# EAGLE design doorjamb_rev_a (EAGLE 7.6.0)
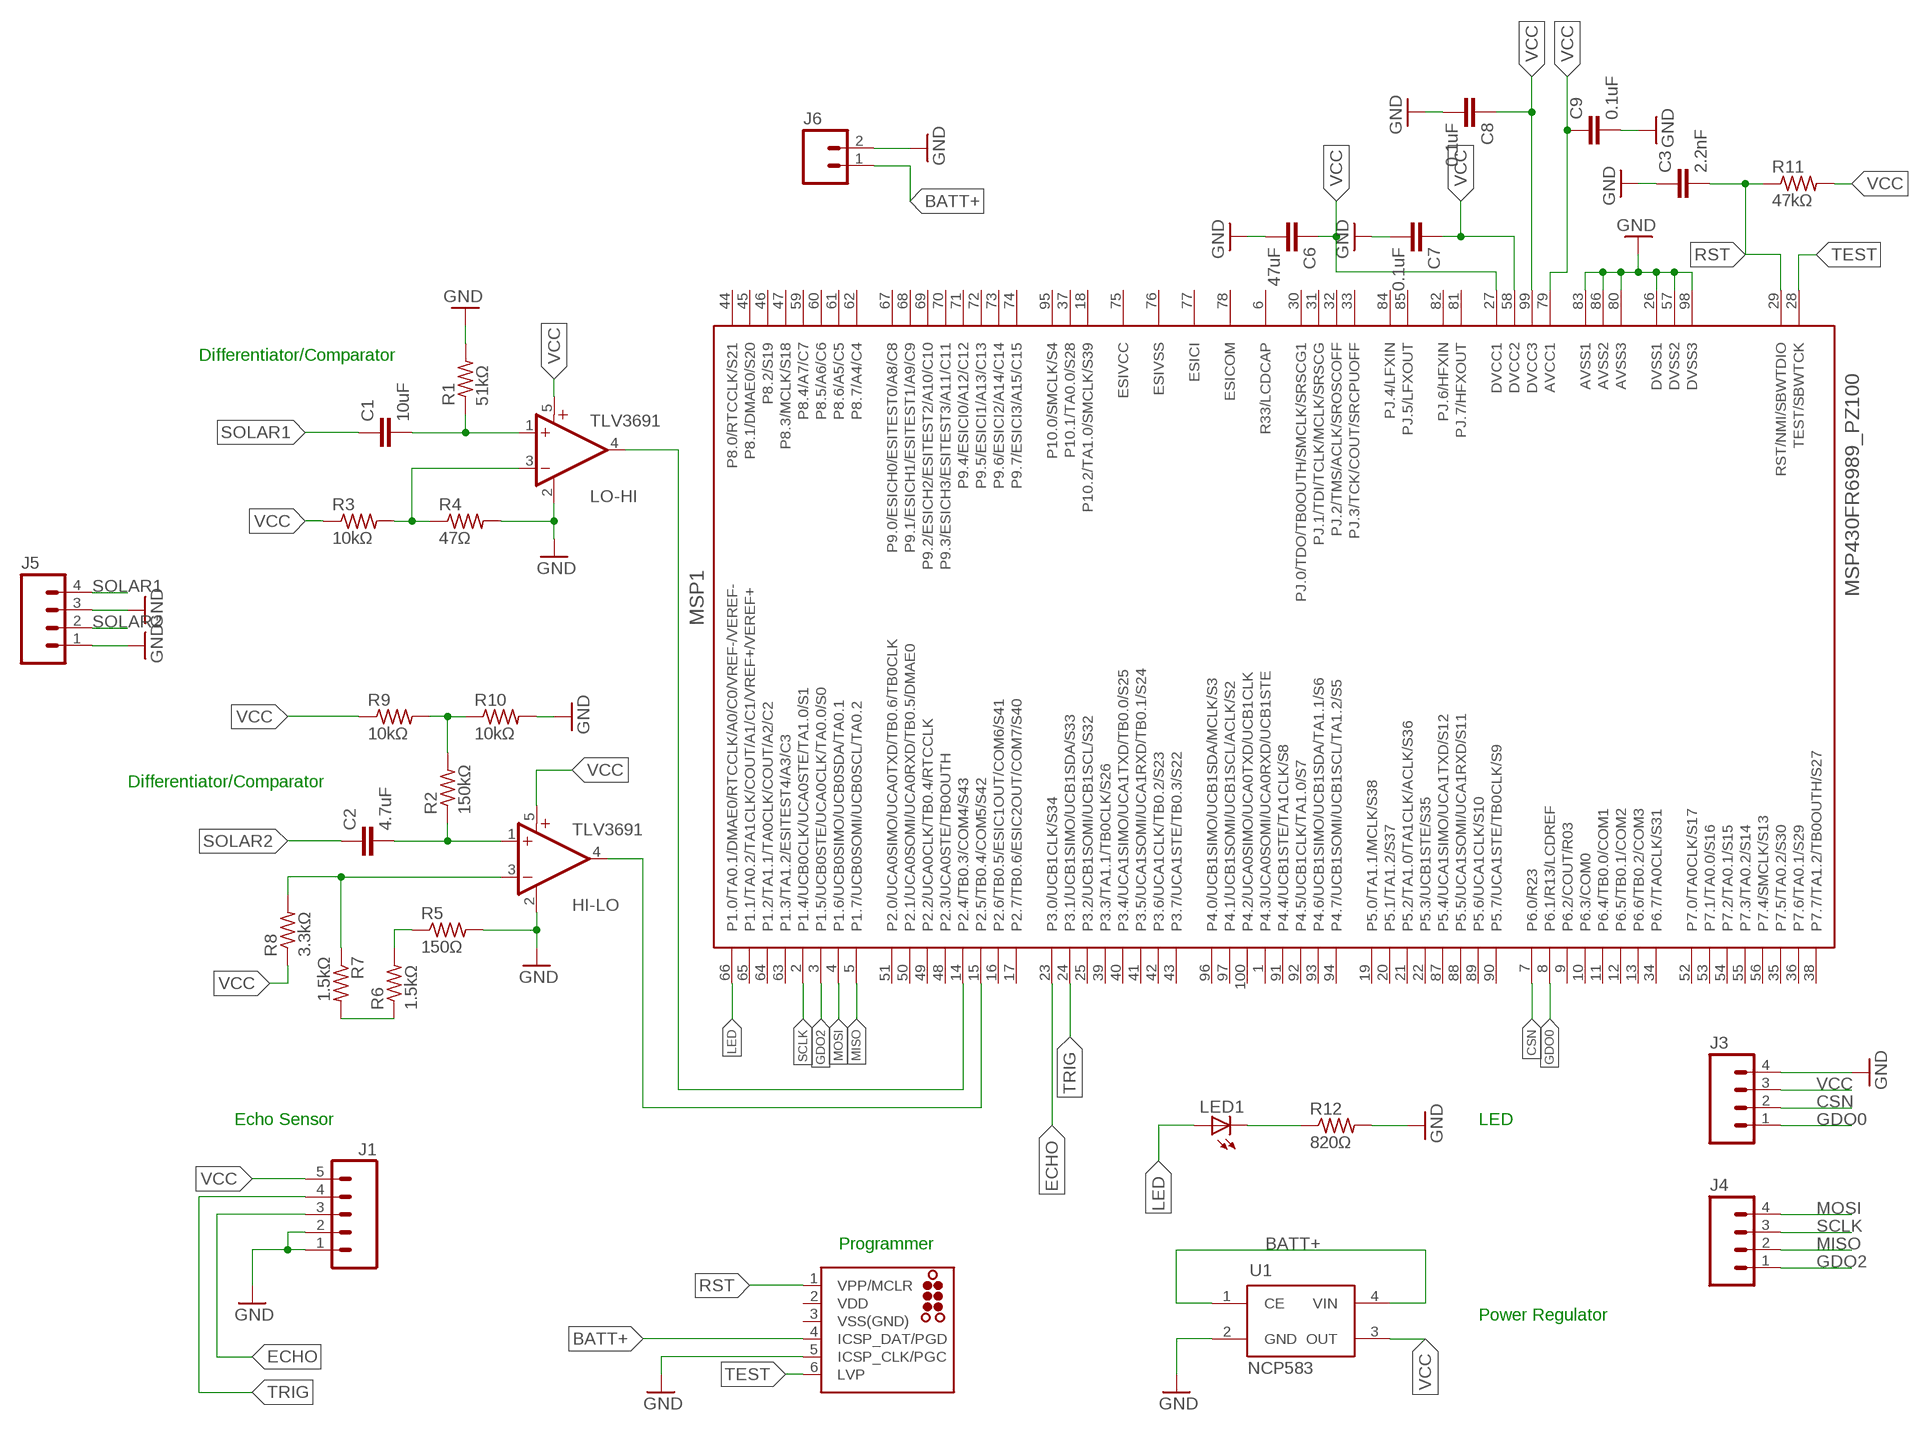
[diagram p0: schematic, sheet 1]

## Parts
C1  10uF  CAP0805  [0805]
C2  4.7uF  CAP0805  [0805]
C3  2.2nF  CAP0805  [0805]
C6  47uF  CAP0805  [0805]
C7  0.1uF  CAP0805  [0805]
C8  0.1uF  CAP0805  [0805]
C9  0.1uF  CAP0805  [0805]
HI-LO  TLV3691  [SC70-5]
J1  M05PTH  [1X05]
J2  TC2030-MCP-NL  [TC2030-MCP-NL]
J3  M04PTH  [1X04]
J4  M04PTH  [1X04]
J5  M04PTH  [1X04]
J6  M02PTH  [1X02]
LED1  LEDCHIP-LED0805  [CHIP-LED0805]
LO-HI  TLV3691  [SC70-5]
MSP1  MSP430FR6989_PZ100  [PZ100]
R1  51kΩ  R-US_M0805  [M0805]
R2  150kΩ  R-US_M0805  [M0805]
R3  10kΩ  R-US_M0805  [M0805]
R4  47Ω  R-US_M0805  [M0805]
R5  150Ω  R-US_M0805  [M0805]
R6  1.5kΩ  R-US_M0805  [M0805]
R7  1.5kΩ  R-US_M0805  [M0805]
R8  3.3kΩ  R-US_M0805  [M0805]
R9  10kΩ  R-US_M0805  [M0805]
R10  10kΩ  R-US_M0805  [M0805]
R11  47kΩ  R-US_M0805  [M0805]
R12  820Ω  R-US_M0805  [M0805]
U1  NCP583  [SC82-AB_1PRIMARY]

## Nets
BATT+: J2.4(ICSP_DAT/PGD) J6.1 U1.1(CE) U1.4(VIN)
CSN: J3.2 MSP1.7(P6.0/R23)
ECHO: J1.3 MSP1.23(P3.0/UCB1CLK/S34)
GDO0: J3.1 MSP1.8(P6.1/R13/LCDREF)
GDO2: J4.1 MSP1.3(P1.5/UCB0STE/UCA0CLK/TA0.0/S0)
GND: C3.1 C6.2 C7.2 C8.2 C9.2 HI-LO.2(GND) J1.1 J1.2 J2.5(ICSP_CLK/PGC) J3.4 J5.1 J5.3 J6.2 LO-HI.2(GND) MSP1.26(DVSS1) MSP1.57(DVSS2) MSP1.80(AVSS3) MSP1.83(AVSS1) MSP1.86(AVSS2) MSP1.98(DVSS3) R1.2 R4.2 R5.2 R10.2 R12.2 U1.2(GND)
LED: LED1.A MSP1.66(P1.0/TA0.1/DMAE0/RTCCLK/A0/C0/VREF-/VEREF-)
MISO: J4.2 MSP1.5(P1.7/UCB0SOMI/UCB0SCL/TA0.2)
MOSI: J4.4 MSP1.4(P1.6/UCB0SIMO/UCB0SDA/TA0.1)
N$1: C1.2 LO-HI.1(+IN) R1.1
N$2: C2.2 HI-LO.1(+IN) R2.1
N$3: LO-HI.3(-IN) R3.2 R4.1
N$4: R5.1 R6.2
N$5: R6.1 R7.2
N$6: HI-LO.3(-IN) R7.1 R8.2
N$7: LED1.C R12.1
N$8: R2.2 R9.2 R10.1
N$9: LO-HI.4(OUT) MSP1.14(P2.4/TB0.3/COM4/S43)
N$10: HI-LO.4(OUT) MSP1.15(P2.5/TB0.4/COM5/S42)
RST: C3.2 J2.1(VPP/MCLR) MSP1.29(RST/NMI/SBWTDIO) R11.1
SCLK: J4.3 MSP1.2(P1.4/UCB0CLK/UCA0STE/TA1.0/S1)
SOLAR1: C1.1 J5.4
SOLAR2: C2.1 J5.2
TEST: J2.6(LVP) MSP1.28(TEST/SBWTCK)
TRIG: J1.4 MSP1.24(P3.1/UCB1SIMO/UCB1SDA/S33)
VCC: C6.1 C7.1 C8.1 C9.1 HI-LO.5(V+) J1.5 J3.3 LO-HI.5(V+) MSP1.27(DVCC1) MSP1.58(DVCC2) MSP1.79(AVCC1) MSP1.99(DVCC3) R3.1 R8.1 R9.1 R11.2 U1.3(OUT)
Unconnected: MSP1.1(P4.3/UCA0SOMI/UCA0RXD/UCB1STE) MSP1.6(R33/LCDCAP) MSP1.9(P6.2/COUT/R03) MSP1.10(P6.3/COM0) MSP1.11(P6.4/TB0.0/COM1) MSP1.12(P6.5/TB0.1/COM2) MSP1.13(P6.6/TB0.2/COM3) MSP1.16(P2.6/TB0.5/ESIC1OUT/COM6/S41) MSP1.17(P2.7/TB0.6/ESIC2OUT/COM7/S40) MSP1.18(P10.2/TA1.0/SMCLK/S39) MSP1.19(P5.0/TA1.1/MCLK/S38) MSP1.20(P5.1/TA1.2/S37) MSP1.21(P5.2/TA1.0/TA1CLK/ACLK/S36) MSP1.22(P5.3/UCB1STE/S35) MSP1.25(P3.2/UCB1SOMI/UCB1SCL/S32) MSP1.30(PJ.0/TDO/TB0OUTH/SMCLK/SRSCG1) MSP1.31(PJ.1/TDI/TCLK/MCLK/SRSCG) MSP1.32(PJ.2/TMS/ACLK/SROSCOFF) MSP1.33(PJ.3/TCK/COUT/SRCPUOFF) MSP1.34(P6.7/TA0CLK/S31) MSP1.35(P7.5/TA0.2/S30) MSP1.36(P7.6/TA0.1/S29) MSP1.37(P10.1/TA0.0/S28) MSP1.38(P7.7/TA1.2/TB0OUTH/S27) MSP1.39(P3.3/TA1.1/TB0CLK/S26) MSP1.40(P3.4/UCA1SIMO/UCA1TXD/TB0.0/S25) MSP1.41(P3.5/UCA1SOMI/UCA1RXD/TB0.1/S24) MSP1.42(P3.6/UCA1CLK/TB0.2/S23) MSP1.43(P3.7/UCA1STE/TB0.3/S22) MSP1.44(P8.0/RTCCLK/S21) MSP1.45(P8.1/DMAE0/S20) MSP1.46(P8.2/S19) MSP1.47(P8.3/MCLK/S18) MSP1.48(P2.3/UCA0STE/TB0OUTH) MSP1.49(P2.2/UCA0CLK/TB0.4/RTCCLK) MSP1.50(P2.1/UCA0SOMI/UCA0RXD/TB0.5/DMAE0) MSP1.51(P2.0/UCA0SIMO/UCA0TXD/TB0.6/TB0CLK) MSP1.52(P7.0/TA0CLK/S17) MSP1.53(P7.1/TA0.0/S16) MSP1.54(P7.2/TA0.1/S15) MSP1.55(P7.3/TA0.2/S14) MSP1.56(P7.4/SMCLK/S13) MSP1.59(P8.4/A7/C7) MSP1.60(P8.5/A6/C6) MSP1.61(P8.6/A5/C5) MSP1.62(P8.7/A4/C4) MSP1.63(P1.3/TA1.2/ESITEST4/A3/C3) MSP1.64(P1.2/TA1.1/TA0CLK/COUT/A2/C2) MSP1.65(P1.1/TA0.2/TA1CLK/COUT/A1/C1/VREF+/VEREF+) MSP1.67(P9.0/ESICH0/ESITEST0/A8/C8) MSP1.68(P9.1/ESICH1/ESITEST1/A9/C9) MSP1.69(P9.2/ESICH2/ESITEST2/A10/C10) MSP1.70(P9.3/ESICH3/ESITEST3/A11/C11) MSP1.71(P9.4/ESICI0/A12/C12) MSP1.72(P9.5/ESICI1/A13/C13) MSP1.73(P9.6/ESICI2/A14/C14) MSP1.74(P9.7/ESICI3/A15/C15) MSP1.75(ESIVCC) MSP1.76(ESIVSS) MSP1.77(ESICI) MSP1.78(ESICOM) MSP1.81(PJ.7/HFXOUT) MSP1.82(PJ.6/HFXIN) MSP1.84(PJ.4/LFXIN) MSP1.85(PJ.5/LFXOUT) MSP1.87(P5.4/UCA1SIMO/UCA1TXD/S12) MSP1.88(P5.5/UCA1SOMI/UCA1RXD/S11) MSP1.89(P5.6/UCA1CLK/S10) MSP1.90(P5.7/UCA1STE/TB0CLK/S9) MSP1.91(P4.4/UCB1STE/TA1CLK/S8) MSP1.92(P4.5/UCB1CLK/TA1.0/S7) MSP1.93(P4.6/UCB1SIMO/UCB1SDA/TA1.1/S6) MSP1.94(P4.7/UCB1SOMI/UCB1SCL/TA1.2/S5) MSP1.95(P10.0/SMCLK/S4) MSP1.96(P4.0/UCB1SIMO/UCB1SDA/MCLK/S3) MSP1.97(P4.1/UCB1SOMI/UCB1SCL/ACLK/S2) MSP1.100(P4.2/UCA0SIMO/UCA0TXD/UCB1CLK)

## Notes on the sheet
- Differentiator/Comparator
- Differentiator/Comparator
- Echo Sensor | LED
- Programmer
- Power Regulator

## Power pins joined to a net without a drawn wire
VDD: J2.2(VDD)
VSS(GND): J2.3(VSS(GND))

## Library data of the parts
C1-C3 C6-C9 = SparkFun-Capacitors:CAP: Capacitor Standard 0603 ceramic capacitor, and 0.1" leaded capacitor.
HI-LO LO-HI = fedpower:TLV3691: 0.9-V to 6.5-V, Nanopower Comparator Datasheets Analog Signal Chain Guide <http://www.ti.com/lit/pdf/slyb174> TLV3691 <http://www.ti.com/lit/ds/symlink/tlv3691.pdf> Manufacturer Product Page TLV3691IDPFR Specifications <http://www.ti.com/general/docs/suppproductinfo.tsp?distId=10&orderablePartNumber=TLV3691IDPFR> Standard Package <javascript:dlgHelp('Standard%20Packaging%20Help');> 1 Category Integrated Circuits (ICs) </product-search/en/integrated-circuits-ics> Family Linear - Comparators </product-search/en/integrated-circuits-ics/linear-comparators/2556221> Series - Packaging <javascript:dlgHelp('Standard%20Packaging%20Help');> Cut Tape (CT) <javascript:dlgHelp('Cut%20Tape%20Help');> Type General Purpose Number of Elements 1 Output Type Push-Pull Voltage - Supply, Single/Dual (±) 0.9 V ~ 6.5 V, ±0.45 V ~ 3.25 V Voltage - Input Offset (Max) 3mV Current - Input Bias (Max) 100pA Current - Output (Typ) 42mA Current - Quiescent (Max) 150nA CMRR, PSRR (Typ) - Propagation Delay (Max) 35µs Hysteresis - Operating Temperature -40°C ~ 125°C Package / Case 6-XFDFN Mounting Type Surface Mount Supplier Device Package 6-X2SON (1x1) Online Catalog Comparators - 1 element </catalog/en/partgroup/comparators-1-element/3112?mpart=TLV3691IDPFR&vendor=296&WT.z_ref_page_type=PS&WT.z_ref_page_sub_type=PD&WT.z_ref_page_id=PD&WT.z_ref_page_event=DC_Link_Table> Other Names 296-37242-1
J1 = SparkFun-Connectors:M05: Header 5 Standard 5-pin 0.1" header. Use with straight break away headers (SKU : PRT-00116), right angle break away headers (PRT-00553), swiss pins (PRT-00743), machine pins (PRT-00117), and female headers (PRT-00115). Molex polarized connector foot print use with SKU : PRT-08230 with associated crimp pins and housings.
J2 = tag-connect_msp430:TC2030: TAG-CONNECT ICSP Connector Manufacturer: Tag-Connect <http://www.tag-connect.com> Cable for easy In-Circuit Serial Programming. Designed for Microchip ICD2, suitable for many others. Two variants - one "with legs" (for hands-free fit on PCB) and another "without legs" for quick programming. PAD Description 1 MCLR/Vpp 2 Vdd 3 GND 4 PGD (ISPDAT) 5 PGC (ISPCLK) 6 nc (used for LVP) ©2009 ROFA.cz - modified and updated by Robert Darlington ‹rdarlington@gmail.com›
J3-J5 = SparkFun-Connectors:M04: Header 4 Standard 4-pin 0.1" header. Use with straight break away headers (SKU : PRT-00116), right angle break away headers (PRT-00553), swiss pins (PRT-00743), machine pins (PRT-00117), and female headers (PRT-00115). Molex polarized connector foot print use with SKU : PRT-08231 with associated crimp pins and housings. 1MM SMD Version SKU: PRT-10208; PROD_ID: CONN-09696
J6 = SparkFun-Connectors:M02: Standard 2-pin 0.1" header. Use with - straight break away headers ( PRT-00116) - right angle break away headers (PRT-00553) - swiss pins (PRT-00743) - machine pins (PRT-00117) - female headers (PRT-00115) Molex polarized connector foot print use with: PRT-08233 with associated crimp pins and housings. 2.54_SCREWTERM for use with PRT-10571. 3.5mm Screw Terminal footprints for PRT-08084 5mm Screw Terminal footprints for use with PRT-08432
LED1 = led:LED: LED OSRAM: - CHIPLED LG R971, LG N971, LY N971, LG Q971, LY Q971, LO R971, LY R971 LH N974, LH R974 LS Q976, LO Q976, LY Q976 LO Q996 - Hyper CHIPLED LW Q18S LB Q993, LB Q99A, LB R99A - SideLED LS A670, LO A670, LY A670, LG A670, LP A670 LB A673, LV A673, LT A673, LW A673 LH A674 LY A675 LS A676, LA A676, LO A676, LY A676, LW A676 LS A679, LY A679, LG A679 - Hyper Micro SIDELED® LS Y876, LA Y876, LO Y876, LY Y876 LT Y87S - SmartLED LW L88C, LW L88S LB L89C, LB L89S, LG L890 LS L89K, LO L89K, LY L89K LS L896, LA L896, LO L896, LY L896 - TOPLED LS T670, LO T670, LY T670, LG T670, LP T670 LSG T670, LSP T670, LSY T670, LOP T670, LYG T670 LG T671, LOG T671, LSG T671 LB T673, LV T673, LT T673, LW T673 LH T674 LS T676, LA T676, LO T676, LY T676, LB T676, LH T676, LSB T676, LW T676 LB T67C, LV T67C, LT T67C, LS T67K, LO T67K, LY T67K, LW E67C LS E67B, LA E67B, LO E67B, LY E67B, LB E67C, LV E67C, LT E67C LW T67C LS T679, LY T679, LG T679 LS T770, LO T770, LY T770, LG T770, LP T770 LB T773, LV T773, LT T773, LW T773 LH T774 LS E675, LA E675, LY E675, LS T675 LS T776, LA T776, LO T776, LY T776, LB T776 LHGB T686 LT T68C, LB T68C - Hyper Mini TOPLED® LB M676 - Mini TOPLED Santana® LG M470 LS M47K, LO M47K, LY M47K Source: http://www.osram.convergy.de LUXEON: - LUMILED® LXK2-PW12-R00, LXK2-PW12-S00, LXK2-PW14-U00, LXK2-PW14-V00 LXK2-PM12-R00, LXK2-PM12-S00, LXK2-PM14-U00 LXK2-PE12-Q00, LXK2-PE12-R00, LXK2-PE12-S00, LXK2-PE14-T00, LXK2-PE14-U00 LXK2-PB12-K00, LXK2-PB12-L00, LXK2-PB12-M00, LXK2-PB14-N00, LXK2-PB14-P00, LXK2-PB14-Q00 LXK2-PR12-L00, LXK2-PR12-M00, LXK2-PR14-Q00, LXK2-PR14-R00 LXK2-PD12-Q00, LXK2-PD12-R00, LXK2-PD12-S00 LXK2-PH12-R00, LXK2-PH12-S00 LXK2-PL12-P00, LXK2-PL12-Q00, LXK2-PL12-R00 Source: www.luxeon.com KINGBRIGHT: KA-3528ASYC Source: www.kingbright.com
MSP1 = msp430:MSP430FR6989_PZ100
R1-R12 = resistor:R-US_: RESISTOR, American symbol
U1 = ncp583:NCP583: NCP583 - Ultra-Low Iq 150 mA CMOS LDO Regulator with Enable The NCP583 series of low dropout regulators are designed for portable battery powered applications which require precise output voltage accuracy and low quiescent current. These devices feature an enable function which lowers current consumption significantly and are offered in two small packages; SC−82AB and the SOT−563. A 1.0 mF ceramic capacitor is the recommended value to be used with these devices on the output pin.

## Board
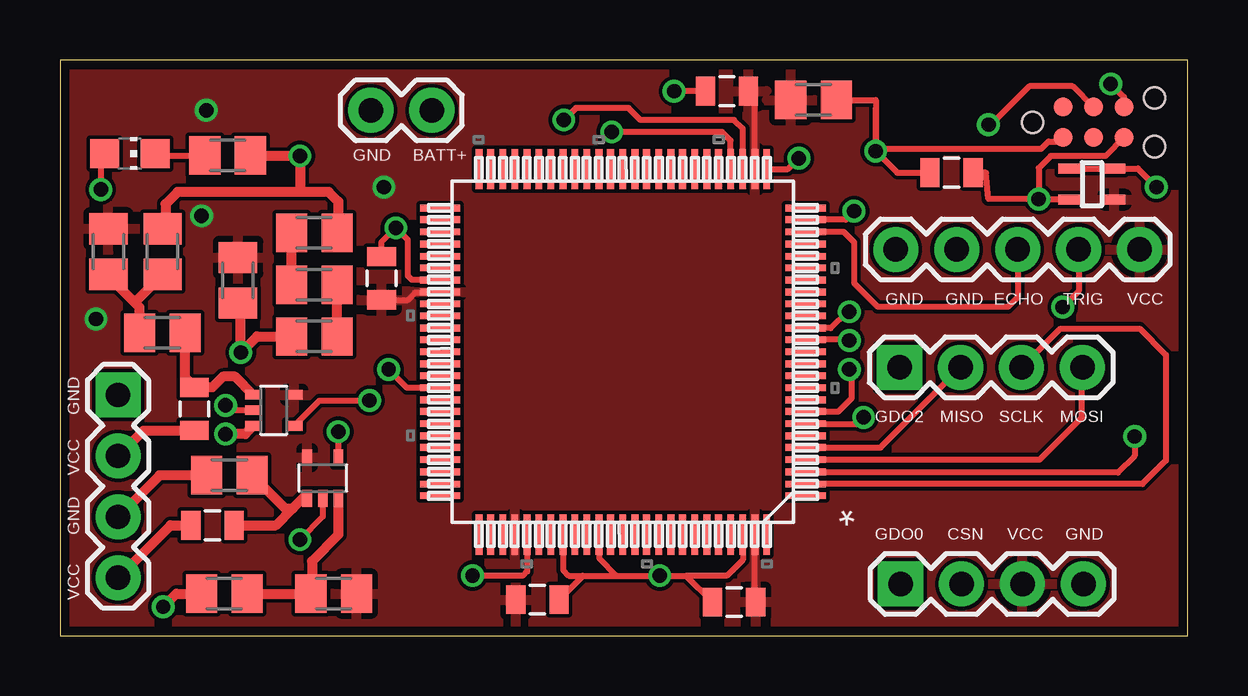
[diagram p1: board, top side]
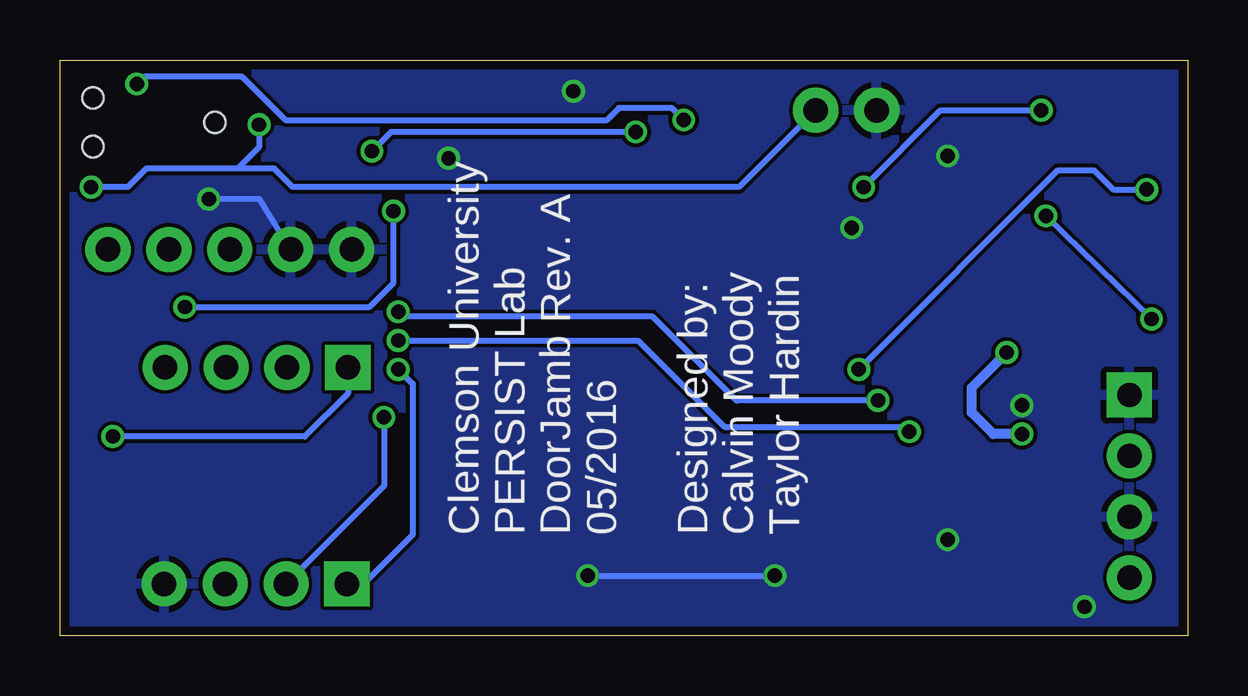
[diagram p2: board, bottom side, seen from below]

Size 47 x 24 mm. Coordinates in mm from the lower left corner, seen from the top.
Outline: 0,0 47,0 47,24 0,24 0,0
Copper layers (1*16): Top 0.0356mm / dielectric 1.5011mm / Bottom 0.0356mm
Design rules "LaenPCBOrder": minimum track width 6mil, minimum drill 13mil, track to track 6mil, track to pad 6mil, pad to pad 6mil, via to via 6mil, smd to smd 6mil, copper to edge 15mil, drill to drill 6mil, minimum pad ring 7mil, minimum via ring 7mil, stop-mask expansion 3mil, vias tented up to drill 0mil, thermal gap 10mil

### Footprints (pad centres in the part's own frame; a part is rotated, then mirrored left to right if it is on the bottom)
0805 = smd 0.8 x 1.2: 1 -0.9,0; 2 0.9,0
SC70-5 = smd 0.4 x 0.7: 1 -0.65,-0.85; 2 0,-0.85; 3 0.65,-0.85; 4 0.65,0.85; 5 -0.65,0.85
1X05 = drill 1.016 pad 1.88: 1 0,0; 2 2.54,0; 3 5.08,0; 4 7.62,0; 5 10.16,0
TC2030-MCP-NL = smd 0.787 x 0.787: 1 1.27,-0.635; 2 1.27,0.635; 3 2.54,-0.635; 4 2.54,0.635; 5 3.81,-0.635; 6 3.81,0.635 | hole 0.889: 0,0; 5.08,-1.016; 5.08,1.016
1X04 = drill 1.016 pad 1.88 square: 1 0,0 | drill 1.016 pad 1.88: 2 2.54,0; 3 5.08,0; 4 7.62,0
1X02 = drill 1.016 pad 1.88: 1 0,0; 2 2.54,0
CHIP-LED0805 = smd 1.2 x 1.2: A 0,-1.05; C 0,1.05
PZ100 = smd 1.676 x 0.279: 1 -7.62,5.994; 2 -7.62,5.512; 3 -7.62,5.004; 4 -7.62,4.496; 5 -7.62,3.988; 6 -7.62,3.505; 7 -7.62,2.997; 8 -7.62,2.489; 9 -7.62,2.007; 10 -7.62,1.499; 11 -7.62,0.991; 12 -7.62,0.508; 13 -7.62,0; 14 -7.62,-0.508; 15 -7.62,-0.991; 16 -7.62,-1.499; 17 -7.62,-2.007; 18 -7.62,-2.489; 19 -7.62,-2.997; 20 -7.62,-3.505; 21 -7.62,-3.988; 22 -7.62,-4.496; 23 -7.62,-5.004; 24 -7.62,-5.512; 25 -7.62,-5.994; 51 7.62,-5.994; 52 7.62,-5.512; 53 7.62,-5.004; 54 7.62,-4.496; 55 7.62,-3.988; 56 7.62,-3.505; 57 7.62,-2.997; 58 7.62,-2.489; 59 7.62,-2.007; 60 7.62,-1.499; 61 7.62,-0.991; 62 7.62,-0.508; 63 7.62,0; 64 7.62,0.508; 65 7.62,0.991; 66 7.62,1.499; 67 7.62,2.007; 68 7.62,2.489; 69 7.62,2.997; 70 7.62,3.505; 71 7.62,3.988; 72 7.62,4.496; 73 7.62,5.004; 74 7.62,5.512; 75 7.62,5.994 | smd 0.279 x 1.676: 26 -5.994,-7.62; 27 -5.512,-7.62; 28 -5.004,-7.62; 29 -4.496,-7.62; 30 -3.988,-7.62; 31 -3.505,-7.62; 32 -2.997,-7.62; 33 -2.489,-7.62; 34 -2.007,-7.62; 35 -1.499,-7.62; 36 -0.991,-7.62; 37 -0.508,-7.62; 38 0,-7.62; 39 0.508,-7.62; 40 0.991,-7.62; 41 1.499,-7.62; 42 2.007,-7.62; 43 2.489,-7.62; 44 2.997,-7.62; 45 3.505,-7.62; 46 3.988,-7.62; 47 4.496,-7.62; 48 5.004,-7.62; 49 5.512,-7.62; 50 5.994,-7.62; 76 5.994,7.62; 77 5.512,7.62; 78 5.004,7.62; 79 4.496,7.62; 80 3.988,7.62; 81 3.505,7.62; 82 2.997,7.62; 83 2.489,7.62; 84 2.007,7.62; 85 1.499,7.62; 86 0.991,7.62; 87 0.508,7.62; 88 0,7.62; 89 -0.508,7.62; 90 -0.991,7.62; 91 -1.499,7.62; 92 -2.007,7.62; 93 -2.489,7.62; 94 -2.997,7.62; 95 -3.505,7.62; 96 -3.988,7.62; 97 -4.496,7.62; 98 -5.004,7.62; 99 -5.512,7.62; 100 -5.994,7.62
M0805 = smd 1.3 x 1.6: 1 -0.95,0; 2 0.95,0
SC82-AB_1PRIMARY = smd 0.406 x 0.914: 1 -1.321,-0.813; 2 -0.025,-0.813; 3 -0.025,1.067; 4 -1.321,1.067

### Placement (x,y rotation side)
C1  6.36,4.6 0 top
C2  5.6,9.45 90 top
C3  37.16,19.3 180 top
C6  27.8,22.7 180 top
C7  13.4,14.9 90 top
C8  28.1,1.4 180 top
C9  19.9,1.5 0 top
HI-LO  8.91,9.39 270 top
J1  34.84,16.1 0 top
J2  40.54,21.4 0 top
J3  35.04,2.15 0 top
J4  35,11.18 0 top
J5  2.42,10.03 270 top
J6  15.5,21.9 180 top
LED1  2.92,20.1 270 top
LO-HI  10.95,6.57 0 top
MSP1  23.46,11.83 180 top
R1  7.06,6.68 180 top
R2  4.27,12.63 180 top
R3  11.41,1.75 180 top
R4  6.85,1.75 180 top
R5  10.6,16.79 0 top
R6  10.6,14.63 180 top
R7  10.6,12.47 0 top
R8  7.42,14.81 270 top
R9  2.02,16.01 270 top
R10  4.28,16.01 90 top
R11  31.41,22.33 180 top
R12  6.99,20.02 0 top
U1  42.89,18.15 270 top

### Tracks (layer width: path | path; a pad name or v marks a point on that pad's centre or on a via)
BATT+  (via drill 0.6)
  Top 0.254: U1.4 U1.1 44.93,19.47 v45.7,18.7 | J2.4 42.22,22.9 40.4,22.9 38.8,21.3 v38.7,21.3
  Bottom 0.254: J6.1 18.7,18.7 37.3,18.7 38.07,19.47 39.6,19.47 | 39.6,19.47 43.4,19.47 44.17,18.7 v45.7,18.7 | v38.7,21.3 38.7,20.37 39.6,19.47
CSN  (via drill 0.6)
  Top 0.254: MSP1.7 33.23,8.83 v33.5,9.1
  Bottom 0.254: v33.5,9.1 33.5,6.23 J3.2
ECHO
  Top 0.254: J1.3 39.92,14.12 39.5,13.7 34.1,13.7 33.1,14.7 33.1,16.4 32.67,16.83 MSP1.23
GDO0  (via drill 0.6)
  Top 0.254: MSP1.8 32.44,9.34 33,9.9 33,11 v32.9,11.1
  Bottom 0.254: v32.9,11.1 32.3,10.5 32.3,4.2 34.35,2.15 J3.1
GDO2  (via drill 0.6)
  Top 0.254: v44.8,8.3 44.8,7.5 44.1,6.8 31.11,6.8 MSP1.3
  Bottom 0.254: J4.1 35,10.1 36.8,8.3 v44.8,8.3
GND  (via drill 0.6)
  Top 0.254: 15.84,14.8 MSP1.57 14.67,14.83 14.5,15 14.5,16.5 v14,17 13.4,16.4 C7.2 | 20.97,1.67 C9.2 21.8,2.5 | MSP1.98 28.46,3.16 27.8,2.5 26.1,2.5 | v25,2.5 26.1,2.5 | 26.1,2.5 C8.2 | MSP1.86 22.47,3.23 23.2,2.5 v25,2.5 | MSP1.80 19.47,2.67 19.3,2.5 v17.2,2.5 | MSP1.83 20.97,2.73 21.2,2.5 21.8,2.5 | 21.8,2.5 v25,2.5 | R12.2 7.94,19.34 | v40.8,18.2 42.08,18.2 U1.2 | v40.8,18.2 38.7,18.2 38.6,19.3 C3.1 | J2.5 43.59,20 41.3,20 40.8,19.5 v40.8,18.2 | C6.2 v25.6,22.7 | MSP1.26 30.35,19.45 v30.8,19.9 | LO-HI.2 10.95,4.95 v10,4 | HI-LO.2 7.11,9.39 v6.9,9.6
  Top 0.406: R1.2 4.15,6.68 J5.3 | v4.3,1.2 4.85,1.75 R4.2 | 4.3,16.96 R10.2 4.4,17.08 4.4,18 4.9,18.5 10,18.5 | 10,18.5 11.2,18.5 11.6,18.1 11.6,16.84 R5.2 | R12.2 9.98,20.02 v10,20 10,18.5
  Bottom 0.254: v25,2.5 v17.2,2.5 | J1.2 38.68,18.2 v40.8,18.2
  pour Bottom (isolate 0.012): 0,24 47,24 47,0 0,0
LED  (via drill 0.6)
  Top 0.254: MSP1.66 14.47,10.33 v13.7,11.1 | 1.7,20.1 LED1.A 1.7,19.93 v1.7,18.6
  Bottom 0.254: v13.7,11.1 5.4,19.4 3.9,19.4 3.1,18.6 v1.7,18.6
MISO
  Top 0.254: MSP1.5 34.2,7.84 J4.2
MOSI
  Top 0.254: MSP1.4 40.83,7.33 42.6,9.1 42.6,11.16
  Top 0.406: 42.6,11.16 J4.4
N$1
  Top 0.406: C1.2 9,4.6 9.7,5.3 | 9.7,5.3 10.12,5.72 LO-HI.1 | R1.1 9.39,5.3 9.7,5.3
N$2
  Top 0.406: R2.1 5.22,10.73 C2.2 6.35,10.35 6.8,10.8 7.3,10.8 HI-LO.1
N$3
  Top 0.406: R4.1 R3.2 10.5,1.79 10.5,3.1 11.6,4.2 LO-HI.3
N$4
  Top 0.406: R6.2 R5.1
N$5
  Top 0.406: R7.2 R6.1
N$6  (via drill 0.6)
  Top 0.406: R8.2 7.54,13.74 v7.54,11.8 8.21,12.47 R7.1 | HI-LO.3 7.72,8.4 v6.9,8.4
  Bottom 0.406: v6.9,8.4 8.1,8.4 9,9.3 9,10.34 v7.54,11.8
N$7
  Top 0.254: LED1.C 3.97,20.02 R12.1
N$8
  Top 0.406: R9.2 2.02,14.98 3,14 | 3,14 3.22,14 R10.1 | R2.2 3.32,13.68 3,14
N$9  (via drill 0.6)
  Top 0.254: v32.9,12.3 32.86,12.34 MSP1.14 | v11.6,8.5 LO-HI.4
  Bottom 0.254: v32.9,12.3 22.9,12.3 19.3,8.7 11.8,8.7
  Bottom 0.406: 11.8,8.7 v11.6,8.5
N$10  (via drill 0.6)
  Top 0.254: HI-LO.4 10.82,9.8 v12.9,9.8 | v32.9,13.5 32.8,13.5 32.12,12.82 MSP1.15
  Bottom 0.254: v12.9,9.8 18.8,9.8 22.3,13.3 32.7,13.3 v32.9,13.5
RST  (via drill 0.6)
  Top 0.254: MSP1.29 27.96,20.64 27.6,21 v23,21 | v34,20.2 34,21.97 | v34,20.2 34.9,19.3 C3.2 | J2.1 41.65,20.6 41.2,20.6 40.9,20.3 34.1,20.3 v34,20.2 | R11.1 34,22.33 v34,20.2
  Bottom 0.254: v23,21 33.2,21 v34,20.2
SCLK
  Top 0.254: 31.1,6.3 MSP1.2 45.12,6.32 46.1,7.3 46.1,11.7 45,12.8 41.7,12.8 J4.3
SOLAR1
  Top 0.406: J5.4 4.61,4.6 C1.1
SOLAR2
  Top 0.406: J5.2 3.48,8.55 C2.1
TEST  (via drill 0.6)
  Top 0.254: MSP1.28 28.46,21.14 28.1,21.5 24.2,21.5 23.7,22 21.5,22 v21,21.5 | J2.6 44.35,22.45 v43.8,23
  Bottom 0.254: v21,21.5 21.5,22 23.7,22 24.2,21.5 37.6,21.5 39.4,23.3 43.5,23.3 v43.8,23 43.6,23.2
TRIG  (via drill 0.6)
  Top 0.254: J1.4 42.46,14.36 v41.8,13.7 | v33.1,17.7 32.74,17.34 MSP1.24
  Bottom 0.254: v41.8,13.7 34.1,13.7 33.1,14.7 v33.1,17.7
VCC  (via drill 0.6)
  Top 0.254: C7.1 14.5,14 14.8,14.3 15.82,14.3 MSP1.58 | C8.1 28.97,1.43 MSP1.99 | MSP1.27 28.97,22.43 C6.1
  Bottom 0.254: v5.9,17.5 v1.5,13.2 | v13.5,18.7 10.3,21.9 v6.1,21.9
  pour Top (isolate 0.012): 0,24 47,24 47,0 0,0

### Text on the board
tPlace: GND | BATT+ | GND | GND | ECHO | TRIG | VCC | GND | GDO2 | MISO | SCLK | MOSI | VCC | GND | GDO0 | CSN | VCC | GND | VCC
bPlace: Clemson University / PERSIST Lab / DoorJamb Rev. A / 05/2016 / / Designed by: / Calvin Moody / Taylor Hardin